# Altium schematic sheet 03_cellular.SchDoc
size D; CompanyName: Signal Laboratories, Inc.; Address1: 3479 Edison Way; Address2: Menlo Park CA 94025; Address3: +1 (877) 778-8435; Address4: siglabs.com; Revision: 1; SheetNumber: 1; SheetTotal: 1
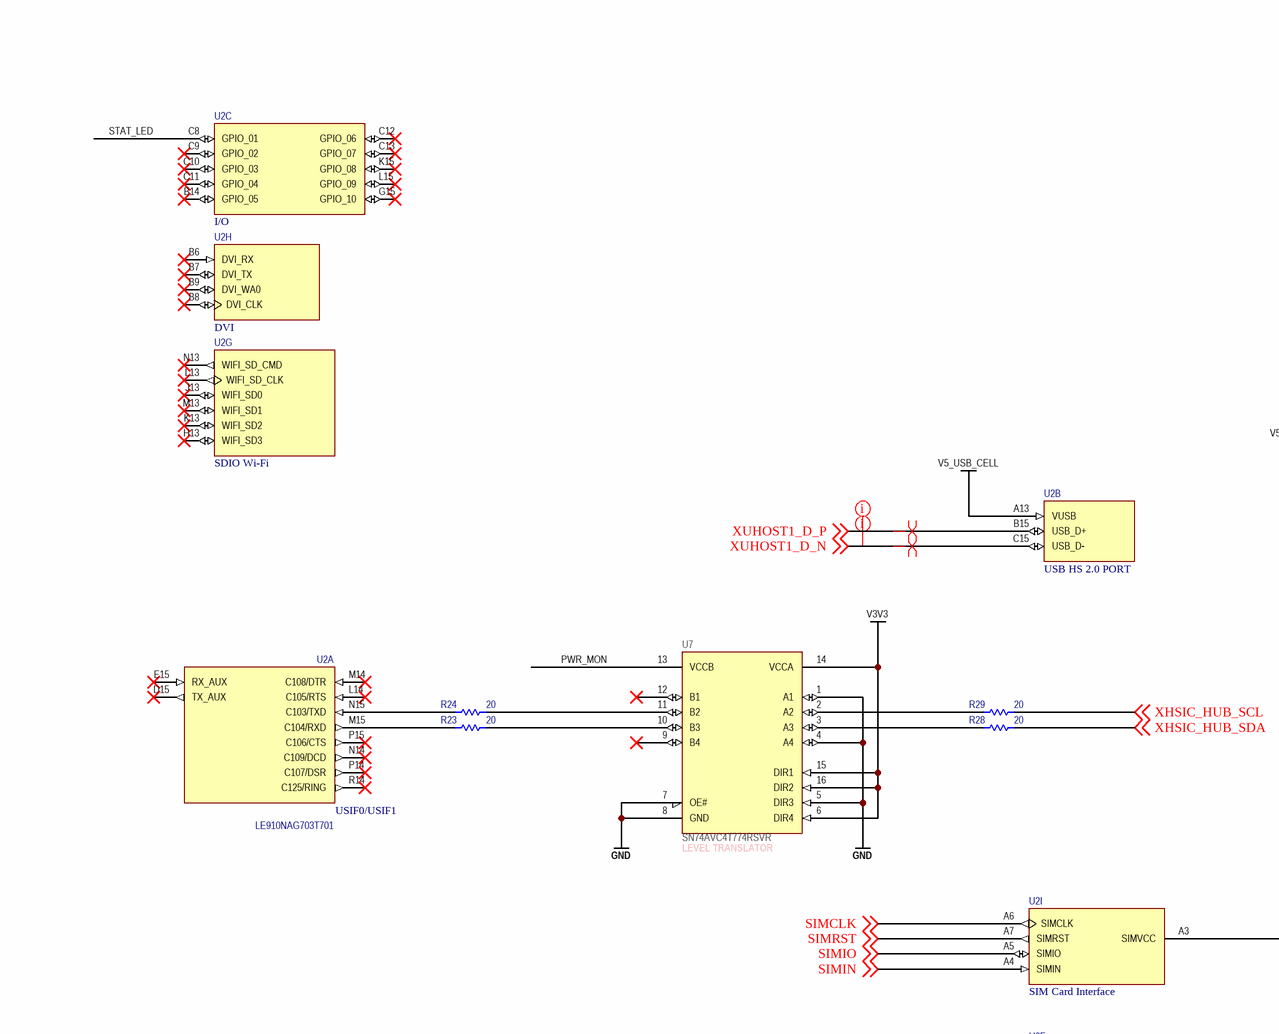
[diagram p0: 03_cellular.SchDoc, top left]
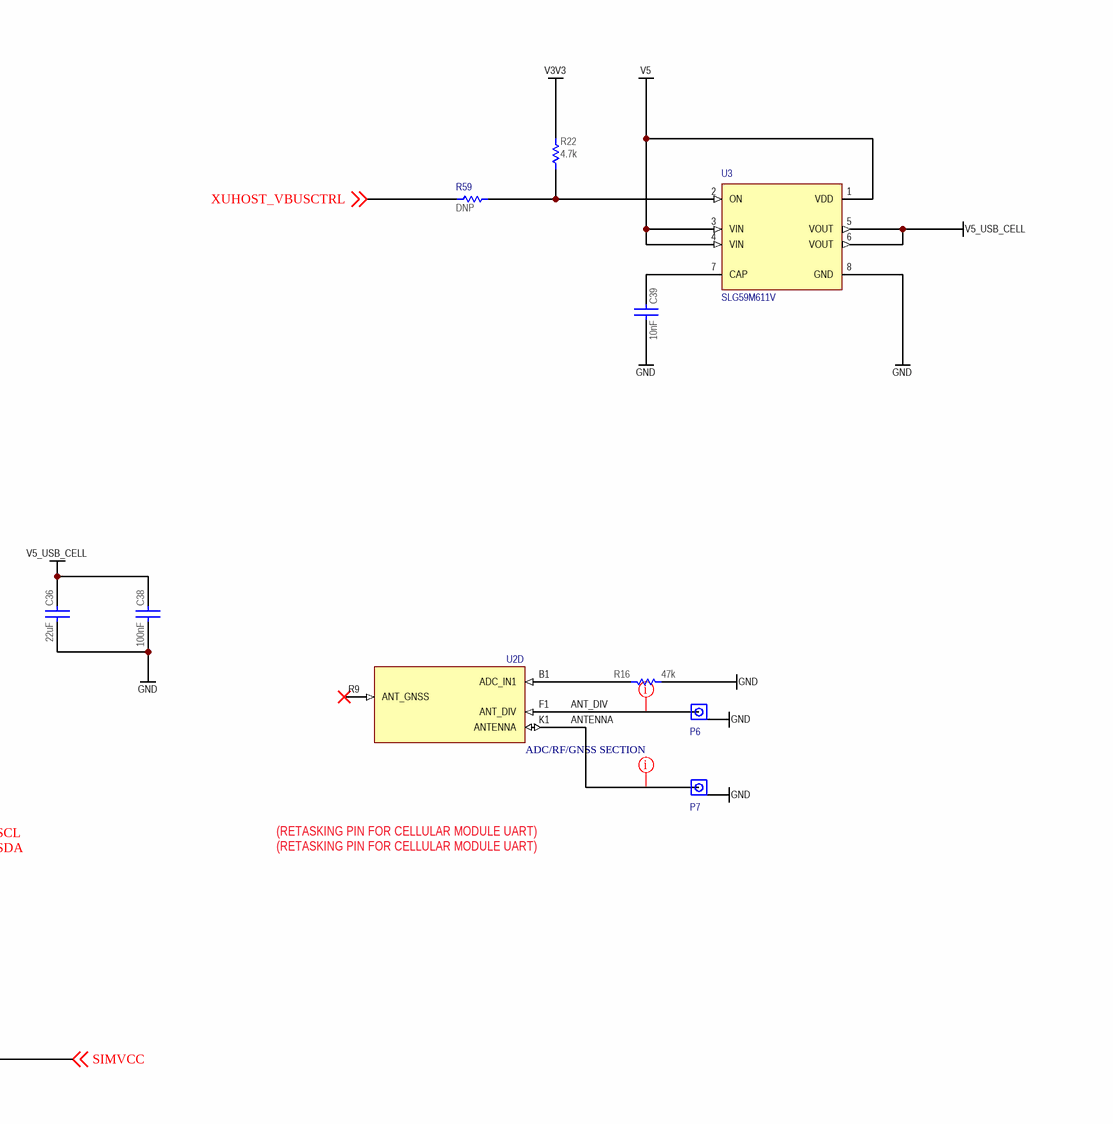
[diagram p1: 03_cellular.SchDoc, top right]
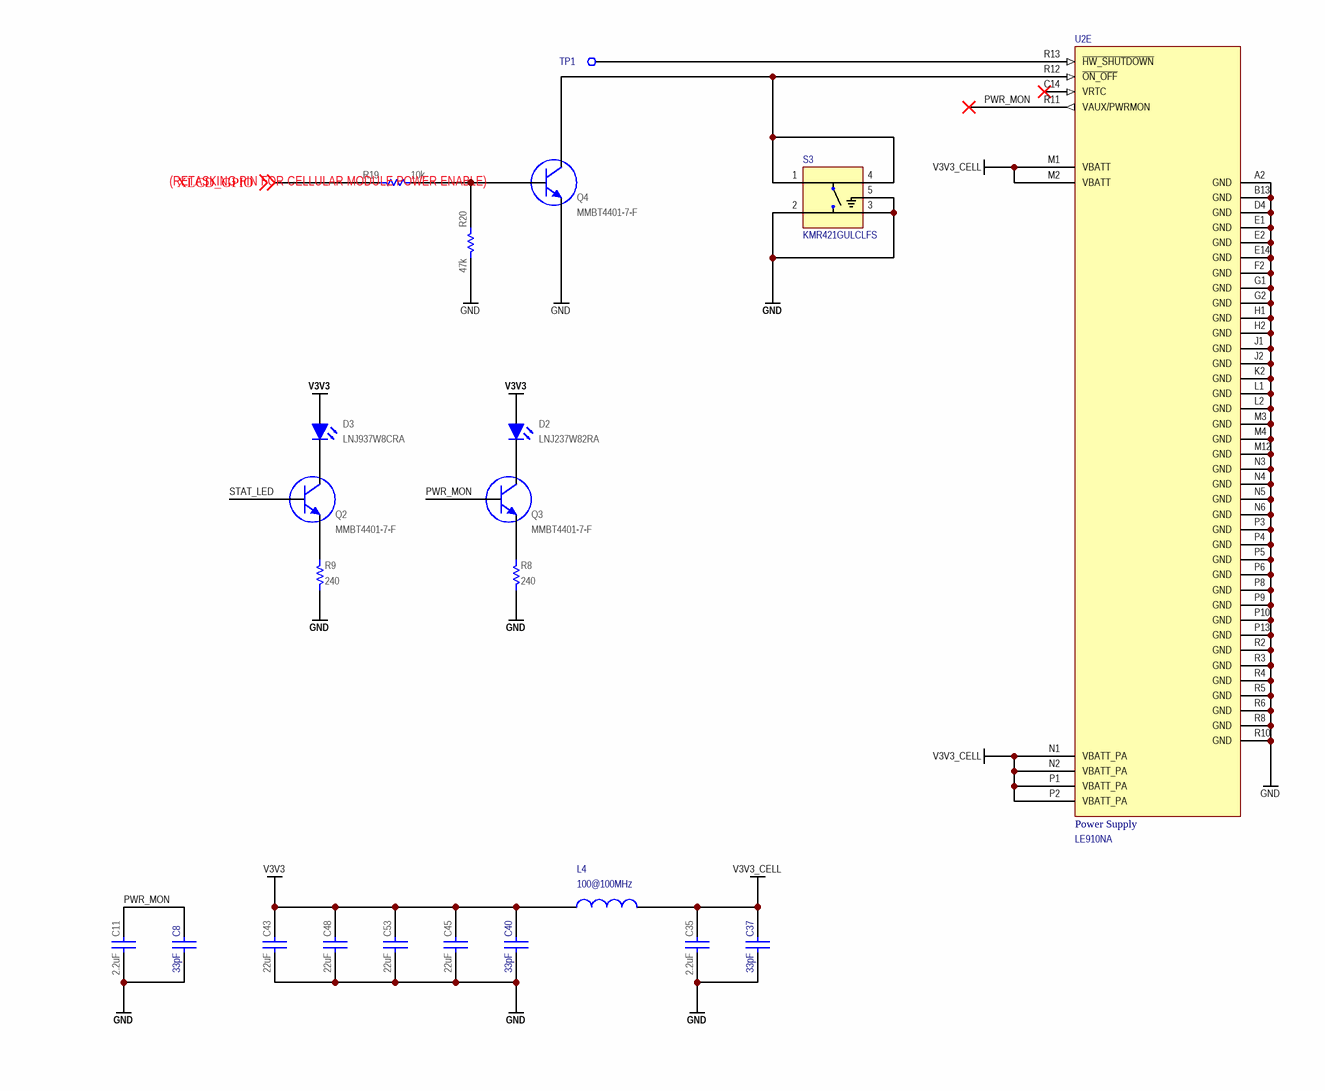
[diagram p2: 03_cellular.SchDoc, bottom left]
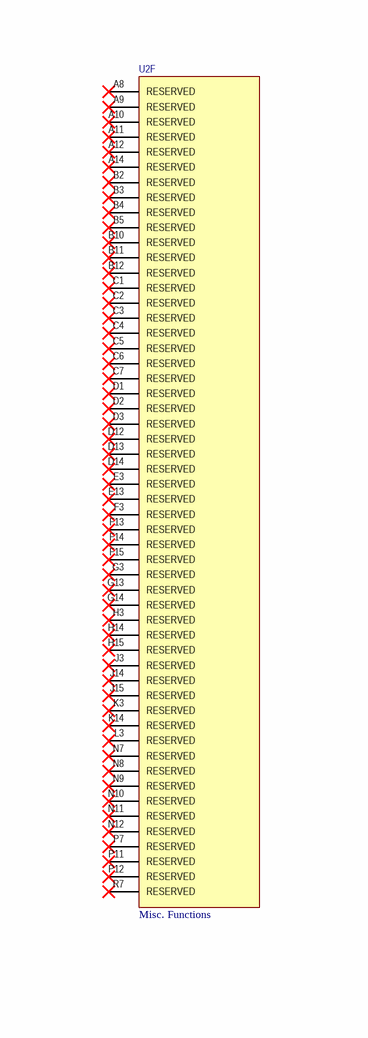
[diagram p3: 03_cellular.SchDoc, bottom right]

## Parts
C8  value 33pF  [0402]  (hidden comment: CBR04C330F5GAC)
C11  value 2.2uF  [CAPC160X80X90L20N]  (hidden comment: C1608X7R1A225M080)
C35  value 2.2uF  [CAPC160X80X90L20N]  (hidden comment: C1608X7R1A225M080)
C36  value 22uF  [CAPC200X125X145L45N]  (hidden comment: C2012X7S1A226M125)
C37  value 33pF  [0402]  (hidden comment: CBR04C330F5GAC)
C38  value 100nF  [CAPC100X50X55L25N]  (hidden comment: GCM155R71H104KE02)
C39  value 10nF  [CAPC100X50X55L25N]  (hidden comment: GCM155R71H103KA55)
C40  value 33pF  [0402]  (hidden comment: CBR04C330F5GAC)
C43  value 22uF  [CAPC200X125X145L45N]  (hidden comment: C2012X7S1A226M125)
C45  value 22uF  [CAPC200X125X145L45N]  (hidden comment: C2012X7S1A226M125)
C48  value 22uF  [CAPC200X125X145L45N]  (hidden comment: C2012X7S1A226M125)
C53  value 22uF  [CAPC200X125X145L45N]  (hidden comment: C2012X7S1A226M125)
D2  LNJ237W82RA  [0603_LED]
D3  LNJ937W8CRA  [0603_LED]
L4  value 100@100MHz  [0603]  (hidden comment: BLM15PX601SN1D)
P6  U.FL-R-SMT(10)  [U.FL-R-SMT(10)]  (value not drawn)
P7  U.FL-R-SMT(10)  [U.FL-R-SMT(10)]  (value not drawn)
Q2  MMBT4401-7-F  [SOT23]
Q3  MMBT4401-7-F  [SOT23]
Q4  MMBT4401-7-F  [SOT23]
R8  value 240  [RESC1005X40N]  (hidden comment: ERJ-2RKF2400X)
R9  value 240  [RESC1005X40N]  (hidden comment: ERJ-2RKF2400X)
R16  value 47k  [RESC1005X40N]  (hidden comment: ERJ-2RKF4702X)
R19  value 10k  [RESC1005X40N]  (hidden comment: ERJ-2RKF1002X)
R20  value 47k  [RESC1005X40N]  (hidden comment: ERJ-2RKF4702X)
R22  value 4.7k  [RESC1005X40N]  (hidden comment: ERJ-2RKF4701X)
R23  value 20  [0402]  (hidden comment: ERJ-2RKF20R0X)
R24  value 20  [0402]  (hidden comment: ERJ-2RKF20R0X)
R28  value 20  [0402]  (hidden comment: ERJ-2RKF20R0X)
R29  value 20  [0402]  (hidden comment: ERJ-2RKF20R0X)
R59  Do Not Place: DNP  [0402]  (hidden comment: ERJ-2RKF20R0X)
S3  KMR421GULCLFS  [SW_KMR421GULCLFS]
TP1  TEST_POINT_SMD_10  [TEST_POINT_SMD_10]  (value not drawn)  (no BOM)
U2  LE910NAG703T701  [LGA144S180P15X15_2820X2820X225_LE910NAG703T701(Primary)]  (parts A,B,C,D,E,F,G,H,I of 9)
U3  SLG59M611V  [DFN200X150X80-8N]
U7  SN74AVC4T774RSVR  [RSV]

## Nets
GND: C8.2 C11.1 C35.1 C36.1 C37.2 C38.1 C39.1 C40.2 C43.1 C45.1 C48.1 C53.1 P6.2(GND) P7.2(GND) Q4.2(E) R8.2 R9.2 R16.1 R20.1 S3.2 S3.3 S3.5(G) U2.A2(GND) U2.B13(GND) U2.D4(GND) U2.E1(GND) U2.E2(GND) U2.E14(GND) U2.F2(GND) U2.G1(GND) U2.G2(GND) U2.H1(GND) U2.H2(GND) U2.J1(GND) U2.J2(GND) U2.K2(GND) U2.L1(GND) U2.L2(GND) U2.M3(GND) U2.M4(GND) U2.M12(GND) U2.N3(GND) U2.N4(GND) U2.N5(GND) U2.N6(GND) U2.P3(GND) U2.P4(GND) U2.P5(GND) U2.P6(GND) U2.P8(GND) U2.P9(GND) U2.P10(GND) U2.P13(GND) U2.R2(GND) U2.R3(GND) U2.R4(GND) U2.R5(GND) U2.R6(GND) U2.R8(GND) U2.R10(GND) U3.8(GND) U7.1(A1) U7.4(A4) U7.5(DIR3) U7.7(OE#) U7.8(GND)
V3V3: C40.1 C43.2 C45.2 C48.2 C53.2 D2.1(A) D3.1(A) L4.1 R22.2 U7.6(DIR4) U7.14(VCCA) U7.15(DIR1) U7.16(DIR2)
V3V3_CELL: C35.2 C37.1 L4.2 U2.M1(VBATT) U2.M2(VBATT) U2.N1(VBATT_PA) U2.N2(VBATT_PA) U2.P1(VBATT_PA) U2.P2(VBATT_PA)
V5: U3.1(VDD) U3.3(VIN) U3.4(VIN)
V5_USB_CELL: C36.2 C38.2 U2.A13(VUSB) U3.5(VOUT) U3.6(VOUT)
ANT_DIV: P6.1(RF) U2.F1(ANT_DIV)
ANTENNA: P7.1(RF) U2.K1(ANTENNA)
PWR_MON: C8.1 C11.2 Q3.1(B) U2.R11(VAUX/PWRMON) U7.13(VCCB)
SIMCLK: U2.A6(SIMCLK) ; off-sheet SIMCLK
SIMIN: U2.A4(SIMIN) ; off-sheet SIMIN
SIMIO: U2.A5(SIMIO) ; off-sheet SIMIO
SIMRST: U2.A7(SIMRST) ; off-sheet SIMRST
SIMVCC: U2.A3(SIMVCC) ; off-sheet SIMVCC
STAT_LED: Q2.1(B) U2.C8(GPIO_01)
XHSIC_HUB_SCL: R29.1 ; off-sheet XHSIC_HUB_SCL
XHSIC_HUB_SDA: R28.1 ; off-sheet XHSIC_HUB_SDA
XLCD_GPIO: R19.2 ; off-sheet XLCD_GPIO
XUHOST1_D_N: U2.C15(USB_D-) ; off-sheet XUHOST1_D_N
XUHOST1_D_P: U2.B15(USB_D+) ; off-sheet XUHOST1_D_P
XUHOST_VBUSCTRL: R59.2 ; off-sheet XUHOST_VBUSCTRL
NetC39_2: C39.2 U3.7(CAP)
NetD2_2: D2.2(K) Q3.3(C)
NetD3_2: D3.2(K) Q2.3(C)
NetQ2_2: Q2.2(E) R9.1
NetQ3_2: Q3.2(E) R8.1
NetQ4_1: Q4.1(B) R19.1 R20.2
NetQ4_3: Q4.3(C) S3.1 S3.4 U2.R12(~{ON_OFF})
NetR16_2: R16.2 U2.B1(ADC_IN1)
NetR22_1: R22.1 R59.1 U3.2(ON)
NetR23_1: R23.1 U7.10(B3)
NetR23_2: R23.2 U2.M15(C104/RXD)
NetR24_1: R24.1 U7.11(B2)
NetR24_2: R24.2 U2.N15(C103/TXD)
NetR28_2: R28.2 U7.3(A3)
NetR29_2: R29.2 U7.2(A2)
NetTP1_1: TP1.1 U2.R13(~{HW_SHUTDOWN})

Not connected (* = marked no-connect by the designer): U2 A8(RESERVED)* A9(RESERVED)* A10(RESERVED)* A11(RESERVED)* A12(RESERVED)* A14(RESERVED)* B2(RESERVED)* B3(RESERVED)* B4(RESERVED)* B5(RESERVED)* B6(DVI_RX)* B7(DVI_TX)* B8(DVI_CLK)* B9(DVI_WA0)* B10(RESERVED)* B11(RESERVED)* B12(RESERVED)* B14(GPIO_05)* C1(RESERVED)* C2(RESERVED)* C3(RESERVED)* C4(RESERVED)* C5(RESERVED)* C6(RESERVED)* C7(RESERVED)* C9(GPIO_02)* C10(GPIO_03)* C11(GPIO_04)* C12(GPIO_06)* C13(GPIO_07)* C14(VRTC)* D1(RESERVED)* D2(RESERVED)* D3(RESERVED)* D12(RESERVED)* D13(RESERVED)* D14(RESERVED)* D15(TX_AUX)* E3(RESERVED)* E13(RESERVED)* E15(RX_AUX)* F3(RESERVED)* F13(RESERVED)* F14(RESERVED)* F15(RESERVED)* G3(RESERVED)* G13(RESERVED)* G14(RESERVED)* G15(GPIO_10)* H3(RESERVED)* H13(WIFI_SD3)* H14(RESERVED)* H15(RESERVED)* J3(RESERVED)* J13(WIFI_SD0)* J14(RESERVED)* J15(RESERVED)* K3(RESERVED)* K13(WIFI_SD2)* K14(RESERVED)* K15(GPIO_08)* L3(RESERVED)* L13(WIFI_SD_CLK)* L14(C105/RTS)* L15(GPIO_09)* M13(WIFI_SD1)* M14(C108/DTR)* N7(RESERVED)* N8(RESERVED)* N9(RESERVED)* N10(RESERVED)* N11(RESERVED)* N12(RESERVED)* N13(WIFI_SD_CMD)* N14(C109/DCD)* P7(RESERVED)* P11(RESERVED)* P12(RESERVED)* P14(C107/DSR)* P15(C106/CTS)* R7(RESERVED)* R9(ANT_GNSS)* R14(C125/RING)*; U7 9(B4)* 12(B1)*

## Layout directives
net class RF: ANT_DIV, ANTENNA
net class USB: XUHOST1_D_N, XUHOST1_D_P
differential pair: XUHOST1_D_N, XUHOST1_D_P

## Notes on the sheet
- (RETASKING PIN FOR CELLULAR MODULE UART)
- (near U7) LEVEL TRANSLATOR
- (RETASKING PIN FOR CELLULAR MODULE POWER ENABLE)
- Title
- Engineer
- Revision
- Drawn By
- Sheet
- of
- Checked By
- Date
- (in symbol LE910NAG703T701, part A) USIF0/USIF1
- (in symbol LE910NAG703T701, part B) USB HS 2.0 PORT
- (in symbol LE910NAG703T701, part C) I/O
- (in symbol LE910NAG703T701, part D) ADC/RF/GNSS SECTION
- (in symbol LE910NAG703T701, part E) Power Supply
- (in symbol LE910NAG703T701, part F) Misc. Functions
- (in symbol LE910NAG703T701, part G) SDIO Wi-Fi
- (in symbol LE910NAG703T701, part H) DVI
- (in symbol LE910NAG703T701, part I) SIM Card Interface

## Library data of the parts
C8 C37 C40 = CAP 0603: Ceramic Capacitor 33pF ±1% 50V NP0 0402; Manufacturer: Kemet; Tr: -55:125; Voltage: 50V; Manufacturer P/N: CBR04C330F5GAC; Package: 0402; Do Not Place: *; Tolerance: ±1%
C11 C35 = CAP: Ceramic Capacitor 2.2uF ±20% 10V X7R 0603; Manufacturer: TDK; Tr: -55:125; Manufacturer P/N: C1608X7R1A225M080; Tolerance: ±20%; Voltage: 10V; Footprint: *; Package: 0603
C36 C43 C45 C48 C53 = CAP: Ceramic Capacitor 22uF ±20% 10V X7S 0805; Manufacturer: TDK; Tr: -55:125; Manufacturer P/N: C2012X7S1A226M125; Tolerance: ±20%; Voltage: 10V; Package: 0805
C38 = CAP: Ceramic Capacitor 100nF ±10% 50V X7R 0402; Manufacturer: Murata; Tr: -55:125; Manufacturer P/N: GCM155R71H104KE02; Tolerance: ±10%; Voltage: 50V; Footprint: *; Package: 0402
C39 = CAP: Ceramic Capacitor 10nF ±10% 50V X7R 0402; Manufacturer: Murata; Tr: -55:125; Manufacturer P/N: GCM155R71H103KA55; Tolerance: ±10%; Voltage: 50V; Footprint: *; Package: 0402
D2 = LED0603RD: LED, SMT 0603, Color Red, 5mA, 1.85V; Manufacturer: Panasonic; Manufacturer P/N: LNJ237W82RA; Package: 0603 Polarized
D3 = LED0603GR: LED, SMT 0603, Color Blue, 5mA, 2.9V; Manufacturer: Panasonic; Manufacturer P/N: LNJ937W8CRA; Package: 0603 Polarized
L4 = IND 0402: Ferrite Bead 100-Ohm @ 100MHz 2A 0603; Manufacturer: Murata; Manufacturer P/N: BLM18EG101TN1; Tolerance: ±25%; Tr: -55:125; Package: 0603
P6 P7 = U.FL-R-SMT(10): Ultra Miniature Coaxial Jack, 50 Ohms; Manufacturer: Hirose; Manufacturer P/N: U.FL-R-SMT(10)
Q2-Q4 = MMBT4401-7-F: NPN Small Signal Transistor SMD SOT-23; Manufacturer: Diodes, Inc.; Manufacturer P/N: MMBT4401-7-F
R8 R9 = RES: Thick Film Resistor 240 ±1% 0.1W 75V 0402; Manufacturer: Panasonic; Tcr: ±100; Tr: -55:155; Voltage: 75; Power: 0.1; Tolerance: ±1%; Manufacturer P/N: ERJ-2RKF2400X; Alternatives: *; Footprint: *; Package: 0402
R16 R20 = RES: Thick Film Resistor 47k ±1% 0.1W 75V 0402; Manufacturer: Panasonic; Tcr: ±100; Tr: -55:155; Voltage: 75; Power: 0.1; Tolerance: ±1%; Manufacturer P/N: ERJ-2RKF4702X; Alternatives: *; Footprint: *; Package: 0402
R19 = RES: Thick Film Resistor 10k ±1% 0.1W 0402; Manufacturer: Panasonic; Tcr: ±100; Tr: -55:155; Voltage: 75; Power: 0.1; Tolerance: ±1%; Manufacturer P/N: ERJ-2RKF1002X; Alternatives: *; Footprint: *; Package: 0402
R22 = RES: Thick Film Resistor 4.7k ±1% 0.1W 75V 0402; Manufacturer: Panasonic; Tcr: ±100; Tr: -55:155; Voltage: 75; Power: 0.1; Tolerance: ±1%; Manufacturer P/N: ERJ-2RKF4701X; Alternatives: *; Footprint: *; Package: 0402
R23 R24 R28 R29 = RES 0402: Thick Film Resistor 20 ±1% 0402; Manufacturer: Panasonic; Manufacturer P/N: RC0402FR-0720L; Tr: -55:155; Package: 0402; Tolerance: ±1%
R59 = RES 0402: Thick Film Resistor 20 ±1% 0402; Manufacturer: Panasonic; Manufacturer P/N: RC0402FR-0720L; Value: 20; Tr: -55:155; Package: 0402; Tolerance: ±1%
S3 = KMR421GULCLFS: Switch Tactile N.O. SPST Round Button Gull Wing 0.05A 32VDC 1VA 200000Cycles 2N SMD Automotive T/R; Manufacturer: C&K Components; Availability: Good; Package: None; Manufacturer P/N: KMR421GULCLFS; Price: 0.29 USD; Value: *
TP1 = TEST_POINT_SMD_10: Test Point SMD
U2 = LE910NAG703T701: Manufacturer: Telit; Manufacturer P/N: LE910NAG703T701
U3 = SLG59M611V: High-Side Load Switch; Manufacturer: Silego; Package: WFDFN-8 Silego; Manufacturer P/N: SLG59M611V
U7 = SN74AVC4T774RSVR: 4-Bit Dual-Supply Bus Transceiver; Manufacturer: Texas Instruments; Manufacturer P/N: SN74AVC4T774RSVR